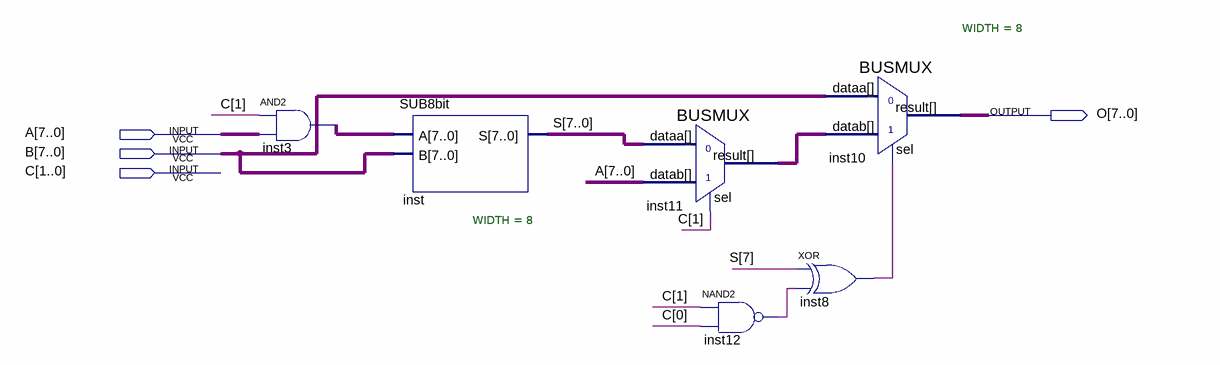
[diagram p0: schematic sheet]
// Quartus schematic ABS_MAX_MIN.bdf as structural Verilog: 6 symbols, 4 pins
module ABS_MAX_MIN (
  input  [7:0] A,
  input  [7:0] B,
  input  [1:0] C,
  output [7:0] O
);

  wire inst8_out, inst12_out;
  wire [7:0] inst3_out, inst11_result, S;

  assign inst3_out = {8{C[1]}} & A;  // AND2 inst3, 8 bits wide
  SUB8bit inst (.A(inst3_out), .B(B), .S(S));
  BUSMUX #(.WIDTH(8)) inst11 (.datab(A), .sel(C[1]), .dataa(S), .result(inst11_result));
  nand inst12 (inst12_out, C[1], C[0]);
  BUSMUX #(.WIDTH(8)) inst10 (.datab(inst11_result), .sel(inst8_out), .dataa(B), .result(O));
  xor inst8 (inst8_out, S[7], inst12_out);
endmodule
